# EAGLE schematic schematic_temperature_sensor_driver (EAGLE 9.3.0)
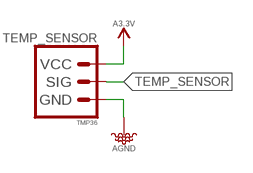
[diagram p0: schematic, sheet 1]

## Parts
TEMP_SENSOR  TMP36  TEMPERATURE-SENSOR_TMP36_TMP36_PTH_VERT  [_MOLEX-0530470310_VERT_PITCH-1.25MM]

## Nets
A3.3V: TEMP_SENSOR.VCC
AGND: TEMP_SENSOR.GND
TEMP_SENSOR: TEMP_SENSOR.SIG

## Library data of the parts
TEMP_SENSOR = _sensors:TEMPERATURE-SENSOR_TMP36; DATASHEET: https://www.analog.com/media/en/technical-documentation/data-sheets/TMP35_36_37.pdf; DATASHEET_CONNECTOR: https://www.molex.com/pdm_docs/sd/530470310_sd.pdf; DATASHEET_CRIMP: https://www.molex.com/pdm_docs/sd/500798000_sd.pdf; DATASHEET_HOUSING: https://www.molex.com/pdm_docs/sd/510210700_sd.pdf; DIST: Digikey; DISTLINK: https://www.digikey.com/products/en?keywords=TMP36GT9Z-ND; DISTLINK_CONNECTOR: https://www.digikey.com/products/en?keywords=WM1732-ND; DISTLINK_CRIMP: https://www.digikey.com/products/en?keywords=WM1142CT-ND; DISTLINK_HOUSING: https://www.digikey.com/products/en?keywords=0510210300; DISTPN: TMP36GT9Z-ND; DISTPN_CONNECTOR: WM1732-ND; DISTPN_CRIMP: WM1142CT-ND; DISTPN_HOUSING: 0510210300; DIST_CONNECTOR: Digikey; DIST_CRIMP: Digikey; DIST_HOUSING: Digikey; MFR: Analog Devices Inc.; MFR_CONNECTOR: Molex, LLC; MFR_CRIMP: Molex, LLC; MFR_HOUSING: Molex, LLC; MPN: TMP36GT9Z; MPN_CONNECTOR: 0530470310; MPN_CRIMP: 0500798000; MPN_HOUSING: 0510210300

## Net classes
0 default: width 0.127 mm, drill 0.254 mm, clearance 0.127 mm